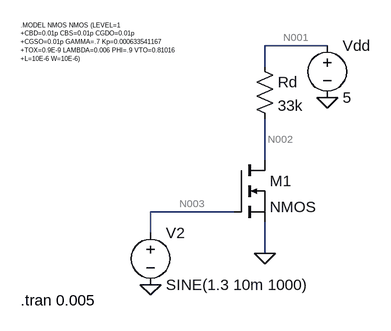
[diagram p0: schematic second.asc]
second.asc, the LTspice schematic file:
Version 4
SHEET 1 880 680
WIRE 224 -48 128 -48
WIRE 128 -16 128 -48
WIRE 128 128 128 64
WIRE 80 208 -48 208
WIRE -48 240 -48 208
WIRE 128 272 128 224
FLAG 224 32 0
FLAG -48 320 0
FLAG 128 272 0
SYMBOL nmos 80 128 R0
SYMATTR InstName M1
SYMBOL voltage 224 -64 R0
WINDOW 123 0 0 Left 0
WINDOW 39 0 0 Left 0
SYMATTR InstName Vdd
SYMATTR Value 5
SYMBOL voltage -48 224 R0
WINDOW 123 0 0 Left 0
WINDOW 39 0 0 Left 0
SYMATTR InstName V2
SYMATTR Value SINE(1.3 10m 1000)
SYMBOL res 112 -32 R0
SYMATTR InstName Rd
SYMATTR Value 33k
TEXT -248 -80 Left 0 !.MODEL NMOS NMOS (LEVEL=1 \n+CBD=0.01p CBS=0.01p CGDO=0.01p \n+CGSO=0.01p GAMMA=.7 Kp=0.000633541167\n+TOX=0.9E-9 LAMBDA=0.006 PHI=.9 VTO=0.81016\n+L=10E-6 W=10E-6)
TEXT -248 344 Left 2 !.tran 0.005

The netlist it stands for:
* second.asc
M1 N002 N003 0 0 NMOS
Vdd N001 0 5
V2 N003 0 SINE(1.3 10m 1000)
Rd N001 N002 33k
.model NMOS NMOS
.model PMOS PMOS
.lib standard.mos
.MODEL NMOS NMOS (LEVEL=1
+CBD=0.01p CBS=0.01p CGDO=0.01p
+CGSO=0.01p GAMMA=.7 Kp=0.000633541167
+TOX=0.9E-9 LAMBDA=0.006 PHI=.9 VTO=0.81016
+L=10E-6 W=10E-6)
.tran 0.005
.backanno
.end

* Results of the author's LTspice run, read from the files saved beside the schematic
* Operating Point, zero values left out:
*   V(n002) = 2.455 V
*   V(n003) = 1.3 V
*   V(n001) = 5 V
*   Id(M1) = 77.13 µA
*   Ib(M1) = -2.465 pA
*   Is(M1) = -77.13 µA
*   I(Rd) = 77.13 µA
*   I(Vdd) = -77.13 µA
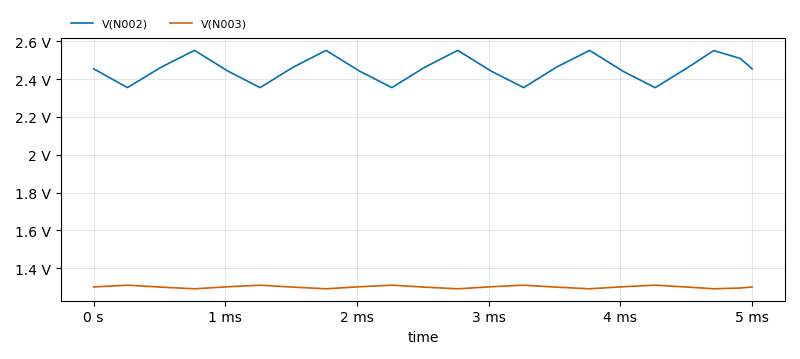
[diagram p1: Transient Analysis of second.asc, plotted from the saved traces]
* Transient Analysis, 1 run:
*   V(N002): min 2.355 V, max 2.553 V, average 2.455 V, rms 2.456 V, last 2.455 V
*   V(N003): min 1.29 V, max 1.31 V, average 1.3 V, rms 1.3 V, last 1.3 V